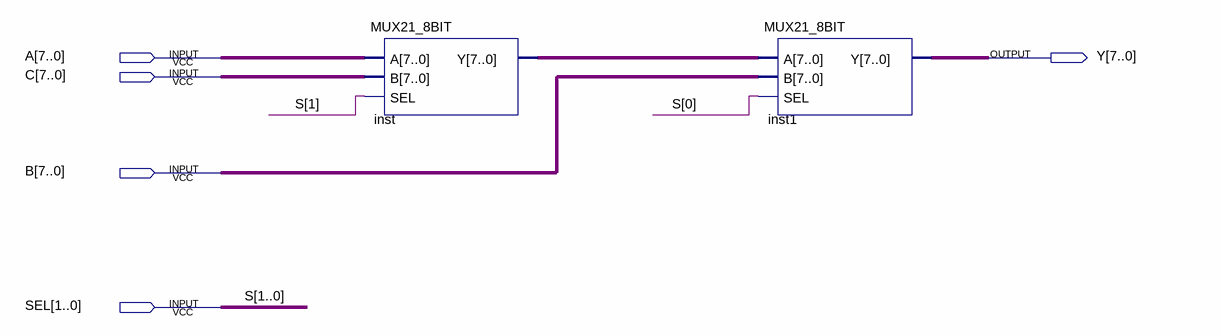
[diagram p0: schematic sheet]
// Quartus schematic MUX31_8BIT.bdf as structural Verilog: 2 symbols, 5 pins
module MUX31_8BIT (
  input  [7:0] A,
  input  [7:0] C,
  input  [7:0] B,
  input  [1:0] SEL,
  output [7:0] Y
);

  wire [7:0] inst_y;

  MUX21_8BIT inst (.A(A), .B(C), .SEL(SEL[1]), .Y(inst_y));
  MUX21_8BIT inst1 (.A(inst_y), .B(B), .SEL(SEL[0]), .Y(Y));

  // Other names for the same wires on the sheet: S[1:0] = SEL
endmodule
